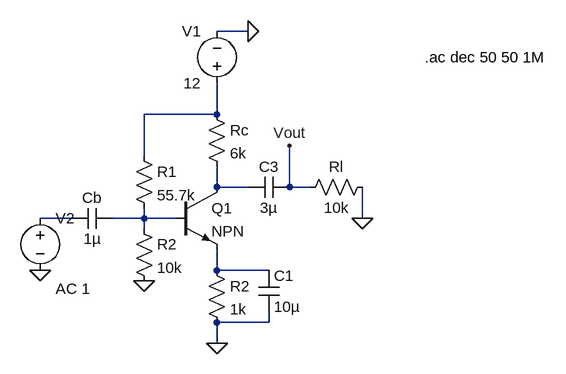
[diagram p0: schematic Draft1.asc]
Draft1.asc, the LTspice schematic file:
Version 4.1
SHEET 1 880 680
WIRE 224 -96 176 -96
WIRE 176 32 176 -16
WIRE 176 32 64 32
WIRE 64 96 64 32
WIRE 176 144 176 112
WIRE 224 144 176 144
WIRE 288 144 288 80
WIRE 320 144 288 144
WIRE -48 192 -96 192
WIRE 64 192 64 176
WIRE 64 192 16 192
WIRE 112 192 64 192
WIRE 400 192 400 144
WIRE 64 208 64 192
WIRE 176 272 176 240
WIRE 256 272 176 272
WIRE 256 352 256 336
WIRE 256 352 176 352
WIRE 176 384 176 352
FLAG 224 -96 0
FLAG 176 384 0
FLAG 64 288 0
FLAG -96 272 0
FLAG 400 192 0
FLAG 288 80 Vout
SYMBOL npn 112 144 R0
SYMATTR InstName Q1
SYMBOL res 48 80 R0
SYMATTR InstName R1
SYMATTR Value 55.7k
SYMBOL res 160 256 R0
SYMATTR InstName R2
SYMATTR Value 1k
SYMBOL res 160 16 R0
SYMATTR InstName Rc
SYMATTR Value 6k
SYMBOL res 416 128 R90
WINDOW 0 0 56 VBottom 2
WINDOW 3 32 56 VTop 2
SYMATTR InstName Rl
SYMATTR Value 10k
SYMBOL res 48 192 R0
SYMATTR InstName R2
SYMATTR Value 10k
SYMBOL voltage 176 0 R180
WINDOW 0 24 96 Left 2
WINDOW 3 24 16 Left 2
WINDOW 123 0 0 Left 0
WINDOW 39 0 0 Left 0
SYMATTR InstName V1
SYMATTR Value 12
SYMBOL cap 240 272 R0
SYMATTR InstName C1
SYMATTR Value 10µ
SYMBOL cap 16 176 R90
WINDOW 0 0 32 VBottom 2
WINDOW 3 32 32 VTop 2
SYMATTR InstName Cb
SYMATTR Value 1µ
SYMBOL cap 288 128 R90
WINDOW 0 0 32 VBottom 2
WINDOW 3 32 32 VTop 2
SYMATTR InstName C3
SYMATTR Value 3µ
SYMBOL voltage -96 176 R0
WINDOW 123 24 124 Left 2
WINDOW 39 0 0 Left 0
SYMATTR InstName V2
SYMATTR Value ""
SYMATTR Value2 AC 1
TEXT 496 -56 Left 2 !.ac dec 50 50 1M

The netlist it stands for:
* Draft1.asc
Q1 N002 N004 N005 0 NPN
R1 N001 N004 55.7k
R2 N005 0 1k
Rc N001 N002 6k
Rl 0 Vout 10k
R2 N004 0 10k
V1 N001 0 12
C1 N005 0 10µ
Cb N004 N003 1µ
C3 Vout N002 3µ
V2 N003 0 AC 1
.model NPN NPN
.model PNP PNP
.lib standard.bjt
.ac dec 50 50 1M
.backanno
.end